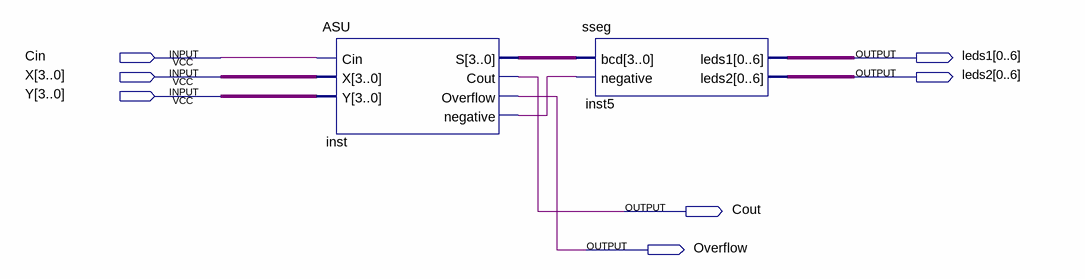
[diagram p0: schematic sheet]
// Quartus schematic lab3_partA_mix.bdf as structural Verilog: 2 symbols, 7 pins
module lab3_partA_mix (
  input  Cin,
  input  [3:0] X,
  input  [3:0] Y,
  output [0:6] leds1,
  output [0:6] leds2,
  output Cout,
  output Overflow
);

  wire inst_negative;
  wire [3:0] inst_s;

  ASU inst (.Cin(Cin), .X(X), .Y(Y), .S(inst_s), .Cout(Cout), .Overflow(Overflow), .negative(inst_negative));
  sseg inst5 (.bcd(inst_s), .negative(inst_negative), .leds1(leds1), .leds2(leds2));
endmodule
